# Altium schematic sheet Thermal Sense Network.SchDoc
size C
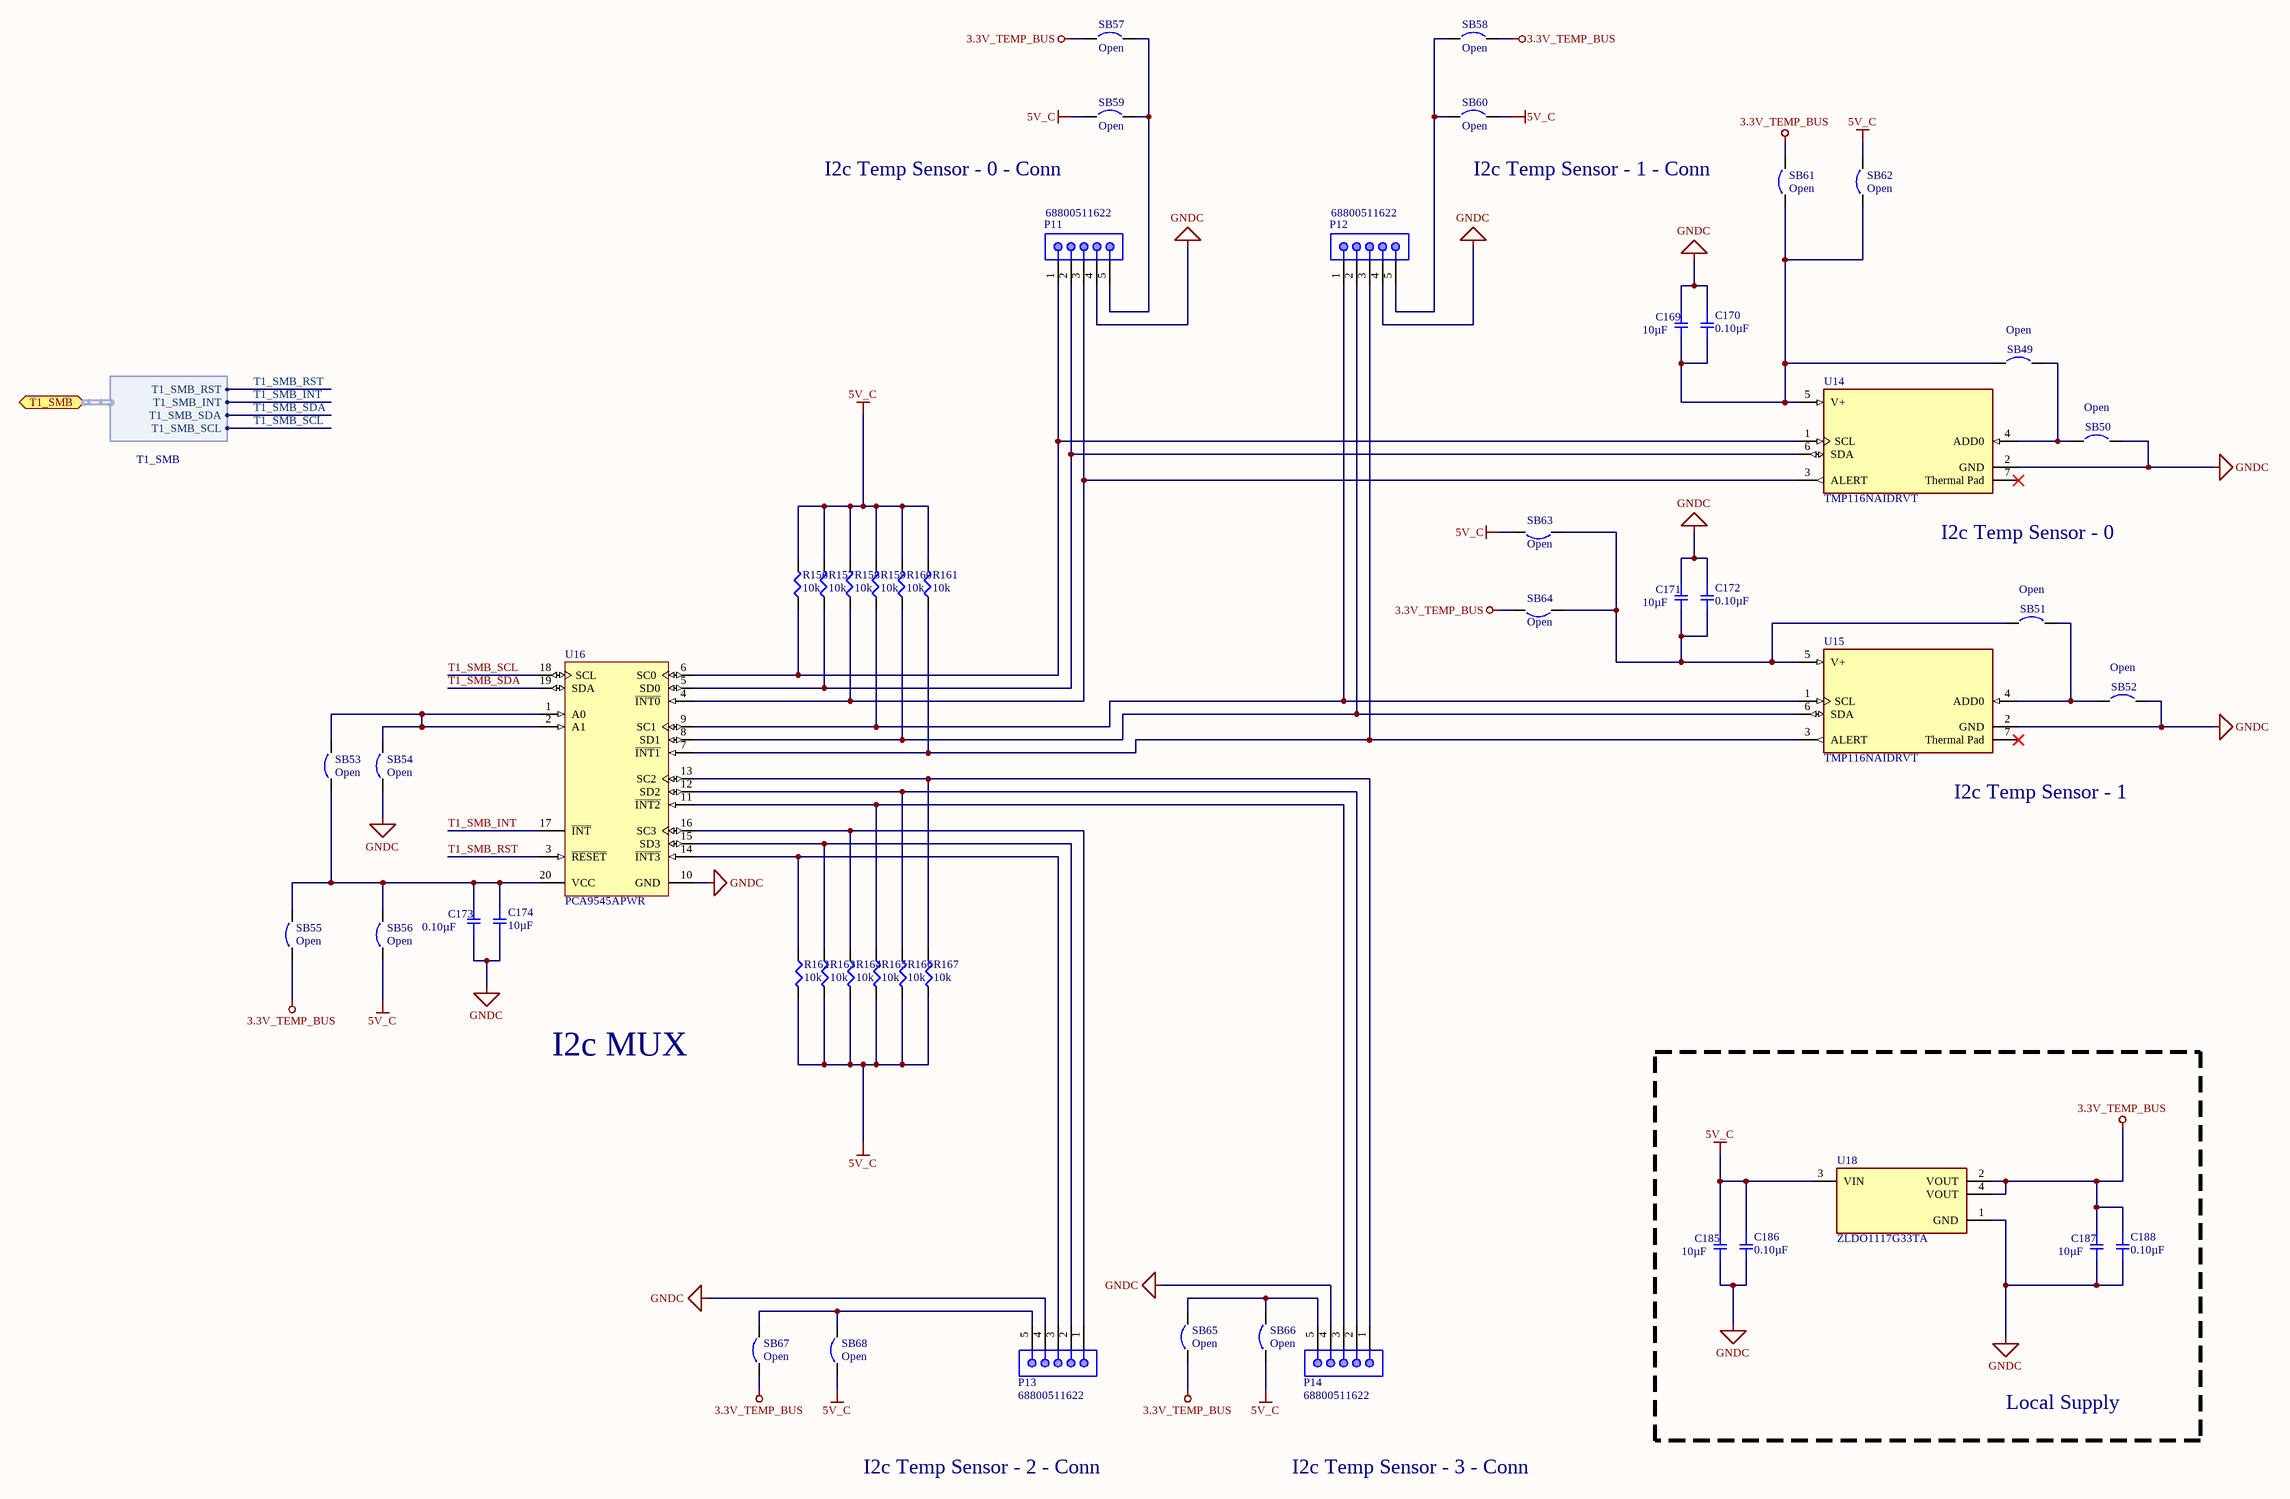
[diagram p0: Thermal Sense Network.SchDoc]

## Parts
C169  10µF  [SMD-0805C]
C170  0.10µF  [SMD-0805C]
C171  10µF  [SMD-0805C]
C172  0.10µF  [SMD-0805C]
C173  0.10µF  [SMD-0805C]
C174  10µF  [SMD-0805C]
C185  10µF  [SMD-0805C]
C186  0.10µF  [SMD-0805C]
C187  10µF  [SMD-0805C]
C188  0.10µF  [SMD-0805C]
P11  68800511622  [68800511622]
P12  68800511622  [68800511622]
P13  68800511622  [68800511622]
P14  68800511622  [68800511622]
R156  10k  [SMD-0603-RES]
R157  10k  [SMD-0603-RES]
R158  10k  [SMD-0603-RES]
R159  10k  [SMD-0603-RES]
R160  10k  [SMD-0603-RES]
R161  10k  [SMD-0603-RES]
R162  10k  [SMD-0603-RES]
R163  10k  [SMD-0603-RES]
R164  10k  [SMD-0603-RES]
R165  10k  [SMD-0603-RES]
R166  10k  [SMD-0603-RES]
R167  10k  [SMD-0603-RES]
SB49  Open  [SB_0603]  (no BOM)
SB50  Open  [SB_0603]  (no BOM)
SB51  Open  [SB_0603]  (no BOM)
SB52  Open  [SB_0603]  (no BOM)
SB53  Open  [SB_0603]  (no BOM)
SB54  Open  [SB_0603]  (no BOM)
SB55  Open  [SB_0603]  (no BOM)
SB56  Open  [SB_0603]  (no BOM)
SB57  Open  [1206 - Solder Bridge]  (no BOM)
SB58  Open  [1206 - Solder Bridge]  (no BOM)
SB59  Open  [1206 - Solder Bridge]  (no BOM)
SB60  Open  [1206 - Solder Bridge]  (no BOM)
SB61  Open  [0805-Solder Bridge]  (no BOM)
SB62  Open  [0805-Solder Bridge]  (no BOM)
SB63  Open  [0805-Solder Bridge]  (no BOM)
SB64  Open  [0805-Solder Bridge]  (no BOM)
SB65  Open  [1206 - Solder Bridge]  (no BOM)
SB66  Open  [1206 - Solder Bridge]  (no BOM)
SB67  Open  [1206 - Solder Bridge]  (no BOM)
SB68  Open  [1206 - Solder Bridge]  (no BOM)
U14  TMP116NAIDRVT  [FP-DRV0006A-MFG]
U15  TMP116NAIDRVT  [FP-DRV0006A-MFG]
U16  PCA9545APWR  [QFN50P350X450X80_HS-21N]
U18  ZLDO1117G33TA  [FP-SOT223-MFG]

## Blocks framed on the sheet
Local Supply: C185-C188 U18

## Ports
T1_SMB (bidir, harness T1_SMB)

## Harnesses
T1_SMB: T1_SMB_SCL, T1_SMB_SDA, T1_SMB_INT, T1_SMB_RST

## Nets
3.3V_TEMP_BUS: C187.1 C188.1 SB55.1 SB57.1 SB58.1 SB61.1 SB64.1 SB65.1 SB67.1 U18.2(VOUT) U18.4(VOUT)
5V_C: C185.1 C186.1 R156.2 R157.2 R158.2 R159.2 R160.2 R161.2 R162.2 R163.2 R164.2 R165.2 R166.2 R167.2 SB56.1 SB59.1 SB60.1 SB62.1 SB63.1 SB66.1 SB68.1 U18.3(VIN)
GNDC: C169.1 C170.1 C171.1 C172.1 C173.1 C174.1 C185.2 C186.2 C187.2 C188.2 P11.4 P12.4 P13.4 P14.4 SB50.2 SB52.2 SB54.1 U14.2(GND) U15.2(GND) U16.10(GND) U18.1(GND)
T1_SMB_INT: U16.17(~{INT}) ; port T1_SMB.T1_SMB_INT
T1_SMB_RST: U16.3(~{RESET}) ; port T1_SMB.T1_SMB_RST
T1_SMB_SCL: U16.18(SCL) ; port T1_SMB.T1_SMB_SCL
T1_SMB_SDA: U16.19(SDA) ; port T1_SMB.T1_SMB_SDA
NetC169_2: C169.2 C170.2 SB49.1 SB61.2 SB62.2 U14.5(V+)
NetC171_2: C171.2 C172.2 SB51.1 SB63.2 SB64.2 U15.5(V+)
NetC173_2: C173.2 C174.2 SB53.1 SB55.2 SB56.2 U16.20(VCC)
NetP11_1: P11.1 R156.1 U14.1(SCL) U16.6(SC0)
NetP11_2: P11.2 R157.1 U14.6(SDA) U16.5(SD0)
NetP11_3: P11.3 R158.1 U14.3(ALERT) U16.4(~{INT0})
NetP11_5: P11.5 SB57.2 SB59.2
NetP12_1: P12.1 R159.1 U15.1(SCL) U16.9(SC1)
NetP12_2: P12.2 R160.1 U15.6(SDA) U16.8(SD1)
NetP12_3: P12.3 R161.1 U15.3(ALERT) U16.7(~{INT1})
NetP12_5: P12.5 SB58.2 SB60.2
NetP13_1: P13.1 R164.1 U16.16(SC3)
NetP13_2: P13.2 R163.1 U16.15(SD3)
NetP13_3: P13.3 R162.1 U16.14(~{INT3})
NetP13_5: P13.5 SB67.2 SB68.2
NetP14_1: P14.1 R167.1 U16.13(SC2)
NetP14_2: P14.2 R166.1 U16.12(SD2)
NetP14_3: P14.3 R165.1 U16.11(~{INT2})
NetP14_5: P14.5 SB65.2 SB66.2
NetSB49_2: SB49.2 SB50.1 U14.4(ADD0)
NetSB51_2: SB51.2 SB52.1 U15.4(ADD0)
NetSB53_2: SB53.2 SB54.2 U16.1(A0) U16.2(A1)

Not connected (* = marked no-connect by the designer): U14 7(Thermal_Pad)*; U15 7(Thermal_Pad)*

## Notes on the sheet
- (near SB59) I2c Temp Sensor - 0 - Conn
- I2c Temp Sensor - 1 - Conn
- (near U14) I2c Temp Sensor - 0
- (near U15) I2c Temp Sensor - 1
- I2c MUX
- I2c Temp Sensor - 2 - Conn
- I2c Temp Sensor - 3 - Conn

## Library data of the parts
C169 C171 C174 C185 C187 = GRM21BC71E106ME11L: CAP CER 10UF 25V X7S 0805; Manufacturer: Murata Electronics North America; Factory Stock: 0; Unit Price (USD): 0.57; Minimum Quantity: 1; Tolerance: ±20%; Datasheets: http://www.murata.com/~/media/webrenewal/support/library/catalog/products/capacitor/mlcc/c02e.pdf; Image: //media.digikey.com/Renders/Murata%20Renders/0805%20(2012%20Metric)%20.85mm.jpg; Digi-Key Part Number: 490-10497-1-ND; Part Number: GRM21BC71E106ME11L; Quantity Available: 8540; @ qty: 0; Packaging: Cut Tape (CT); Series: GRM; Part Status: Active; Value: 10µF; Voltage: 25V; Temperature Coefficient: X7S; Operating Temperature: -55°C ~ 125°C; Features: Derating Recommended; Ratings: -; Applications: General Purpose; Mounting Type: Surface Mount, MLCC; Package / Case: 0805 (2012 Metric); Size / Dimension: 0.079" L x 0.049" W (2.00mm x 1.25mm); Height - Seated (Max): -; Thickness (Max): 0.057" (1.45mm); Lead Spacing: -; Lead Style: -
C170 C172 C173 C186 C188 = GCD21BR71H104KA01L: CAP CER 0.1UF 50V X7R 0805; Manufacturer: Murata Electronics North America; Factory Stock: 0; Unit Price (USD): 0.24; Minimum Quantity: 1; Tolerance: ±10%; Datasheets: http://www.murata.com/~/media/webrenewal/support/library/catalog/products/capacitor/mlcc/c03e.ashx; Image: //media.digikey.com/Renders/Murata%20Renders/0805%28GxM6%29.jpg; Digi-Key Part Number: 490-11955-1-ND; Part Number: GCD21BR71H104KA01L; Quantity Available: 157; @ qty: 0; Packaging: Cut Tape (CT); Series: GCD; Part Status: Active; Value: 0.10µF; Voltage: 50V; Temperature Coefficient: X7R; Operating Temperature: -55°C ~ 125°C; Features: -; Ratings: AEC-Q200; Applications: Automotive; Mounting Type: Surface Mount, MLCC; Package / Case: 0805 (2012 Metric); Size / Dimension: 0.079" L x 0.049" W (2.00mm x 1.25mm); Height - Seated (Max): -; Thickness (Max): 0.049" (1.25mm); Lead Spacing: -; Lead Style: -
P11-P14 = 68800511622: WR-WTB “J” Type THT Vertical Male Shrouded Header, pitch 2.5mm, 5p; Pin Number: 5; Contact Resistance: 20mOhm; Rated Current: 3A; Withstanding Voltage: 800VAC; Working Voltage: 250VAC; ComponentLink1Description: Manufacturer; ComponentLink1URL: http://www.we-online.de; ComponentLink2Description: Datasheet; ComponentLink2URL: https://www.we-online.com/catalog/datasheet/68800511622.pdf; Pitch: 2.5mm; Published Date: January 2020; Publisher: Wurth Elektronik; Mounting Technology: THT; Packaging: Bag; Operating Temperature: -25 to +85degC; Part Number: 68800511622; Gender: Male; Type: Vertical
R156-R167 = ERJ-3GEYJ103V: RES SMD 10K OHM 5% 1/10W 0603; Manufacturer: Panasonic Electronic Components; Factory Stock: 0; Unit Price (USD): 0.00321; @ qty: 1500; Minimum Quantity: 1; Power (Watts): 0.1W, 1/10W; Temperature Coefficient: ±200ppm/°C; Part Number: ERJ-3GEYJ103V; Datasheets: http://industrial.panasonic.com/www-cgi/jvcr13pz.cgi?E+PZ+3+AOA0001+ERJ3GEYJ103V+7+WW; Image: //media.digikey.com/Photos/Panasonic%20Photos/MFG_ERJ-P6W%20Series.jpg; Digi-Key Part Number: P10KGCT-ND; Quantity Available: 7178118; Packaging: Cut Tape (CT); Series: ERJ; Part Status: Active; Value: 10k; Tolerance: ±5%; Composition: Thick Film; Features: Automotive AEC-Q200; Operating Temperature: -55°C ~ 155°C; Package / Case: 0603 (1608 Metric); Supplier Device Package: 0603; Size / Dimension: 0.063" L x 0.031" W (1.60mm x 0.80mm); Height - Seated (Max): 0.022" (0.55mm); Number of Terminations: 2; Failure Rate: -
SB49-SB68 = Solder Bridge: Circuit Breaker; Published: 24-Mar-1999; Revision: July-2002: Re-released for DXP Platform.; Publisher: Altium Limited
U14 U15 = CMP-04948-000020-1: SENSOR DIGITAL -55C-125C 6WSON; Manufacturer: Texas Instruments; Max Supply Voltage: 5.5V; Min Supply Voltage: 1.9V; Standoff Height: 0mm; Accuracy: 0.2%; Operating Supply Current: 3.5-135uA; Max Junction Temp: +150°C; Interface: I2C,SMBus; Resolution: 16bits; Temperature Range High: +125°C; Device Class L1: Sensors; Package: DRV0006A; Temperature Range Low: -55°C; Lead Free: Yes; Digikey Description: SENSOR DIGITAL -55C-125C 6WSON; RoHS: TRUE; Height: 0.8mm; Ambient Temperature Range High: +150°C; Temperature: -55°C to +125°C; ComponentLink2Description: Datasheet; Device Class L3: unset; Ambient Temperature Range Low: -55°C; Category: IC; Octopart: https://octopart.com/tmp116naidrvt-texas+instruments-82367759; Device Class L2: Temperature and Humidity Sensors; Manufacturer Part Number: TMP116NAIDRVT; ComponentLink2URL: http://www.ti.com/lit/ds/symlink/tmp116.pdf; Automotive: No
U16 = CMP-0314-00327-2: 4-Channel I2C and SMBus Multiplexer with Interrupt Logic and Reset Functions, 2.3 to 5.5 V, -40 to 85 degC, 20-pin TSSOP (PW), Green (RoHS & no Sb/Br); Manufacturer: Texas Instruments; Max Frequency(kHz): 400; Interrupt Output: Yes; Channel Width: 4; VCC(Max)(V): 5.5; Simultaneously Active Channels: 1 to 4; VCC(Min)(V): 2.3; tpd max(ns): 1; SubFamily: I2C Multiplexer, Switch; I2C Address: 1110 0xx; fSCLK(Max)(MHz): 400; Code_JEDEC: MO-153; 5V Tolerant I/O: Yes; Vcc range(V): 2.3 to 5.5; PackageReference: PW0020A; Mounting Technology: Surface Mount; Open Drain I/O Type: Yes; ComponentLink1URL: http://www.ti.com/general/docs/lit/getliterature.tsp?genericPartNumber=PCA9545A&fileType=pdf; ComponentLink1Description: Datasheet; PackageVersion: revG, Feb-2011; DatasheetVersion: SCPS147C; PartNumber: PCA9545APWR; Eco-Plan: Green (RoHS & no Sb/Br); Reset Input: Yes; PackageDescription: 20-Pin Plastic Thin Small Outline Package 6.5 x 4.4 mm Body ,0.65 mm Pitch
U18 = CMP-12756-000030-1: IC REG LINEAR 3.3V 1A SOT223-3; Dropout Voltage: 1.11V; Power Dissipation: 15W; Output Voltage Accuracy: 2%; Max Input Voltage: 18V; Output Type: Fixed; Number of Regulators: 1; Min Input Voltage: 2.7V; Min Current Limit: 1.1A; Quiescent Current: 10mA; Polarity: Positive; Length: 6.7mm; Min Operating Temperature: -40°C; Max Output Current: 1A; Min Output Voltage: 3.3V; Width: 3.7mm; Reference Voltage: 3.3V; Number of Pins: 3; Package Quantity: 1000; Tolerance: 2%; Max Operating Temperature: 125°C; Output Voltage: 3.3V; Accuracy: 2%; Case/Package: SOT-223; Lead Free: Lead Free; Radiation Hardening: No; Output Current: 1A; Number of Outputs: 1; Packaging: Tape and Reel; REACH SVHC: No SVHC; Max Power Dissipation: 15W; Height: 1.7mm; Mount: Surface Mount; Weight: 0.000282oz; Nominal Output Voltage: 3.3V